# Altium schematic sheet CON_HDMI_TYPEA.SchDoc: HDMI Type A Connector
size A4; Organization: Altium Limited.; Address1: Level 3, 12a Rodborough Rd; Address2: Frenchs Forest 2086; Address3: NSW; Address4: AUSTRALIA; DocumentNumber: 8; SheetNumber: 8; SheetTotal: 100
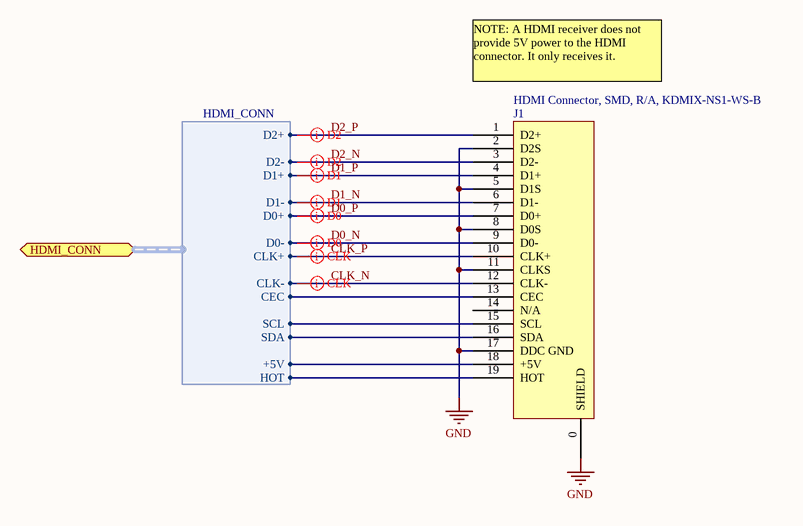
[diagram p0: CON_HDMI_TYPEA.SchDoc]

## Parts
J1  HDMI Connector, SMD, R/A, KDMIX-NS1-WS-B  [HDMI-RA-Kycon]

## Ports
HDMI_CONN (harness HDMI_CONN)

## Harnesses
HDMI_CONN: D2+, D2-, D1+, D1-, D0+, D0-, CLK+, CLK-, CEC, SCL, SDA, +5V, HOT

## Nets
GND: J1.0(SHIELD) J1.2(D2S) J1.5(D1S) J1.8(D0S) J1.11(CLKS) J1.17(DDC_GND)
CLK_N: J1.12(CLK-) ; port HDMI_CONN.CLK-
CLK_P: J1.10(CLK+) ; port HDMI_CONN.CLK+
D0_N: J1.9(D0-) ; port HDMI_CONN.D0-
D0_P: J1.7(D0+) ; port HDMI_CONN.D0+
D1_N: J1.6(D1-) ; port HDMI_CONN.D1-
D1_P: J1.4(D1+) ; port HDMI_CONN.D1+
D2_N: J1.3(D2-) ; port HDMI_CONN.D2-
D2_P: J1.1(D2+) ; port HDMI_CONN.D2+
NetJ1_13: J1.13(CEC) ; port HDMI_CONN.CEC
NetJ1_15: J1.15(SCL) ; port HDMI_CONN.SCL
NetJ1_16: J1.16(SDA) ; port HDMI_CONN.SDA
NetJ1_18: J1.18(+5V) ; port HDMI_CONN.+5V
NetJ1_19: J1.19(HOT) ; port HDMI_CONN.HOT

Not connected (* = marked no-connect by the designer): J1 14(N/A)

## Layout directives
differential pair: CLK_N, CLK_P, D0_N, D0_P, D1_N, D1_P, D2_N, D2_P

## Notes on the sheet
- NOTE: A HDMI receiver does not provide 5V power to the HDMI connector. It only receives it.
- Sheet Title
- Project Title
- Size:
- Date:
- A4
- Assy:
- Time:
- Revision:
- Sheet
- of
- File:

## Library data of the parts
J1 = D-300-0056: HDMI, SMD, R/A KDMIX-NS1-WS-B; Connector type: Right Angle; Max Current: mA; Mounting Technology: Surface Mount; Pin Count: 19; Status: Unreleased; Category: Connector